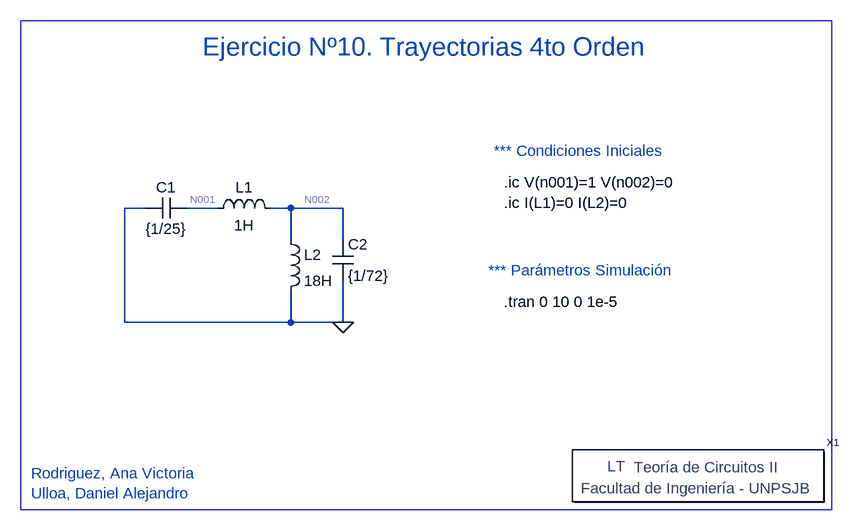
[diagram p0: schematic 10.asc]
10.asc, the LTspice schematic file:
Version 4
SHEET 1 1860 1348
WIRE -144 -32 -176 -32
WIRE -32 -32 -80 -32
WIRE 80 -32 48 -32
WIRE 160 -32 80 -32
WIRE 80 16 80 -32
WIRE 160 16 160 -32
WIRE -176 144 -176 -32
WIRE 80 144 80 96
WIRE 80 144 -176 144
WIRE 160 144 160 80
WIRE 160 144 80 144
FLAG 160 144 0
SYMBOL Circuitos2\\Letreros\\Teoría\ de\ Circuitos\ II 704 384 R0
SYMATTR InstName X1
SYMBOL ind -48 -16 R270
WINDOW 0 32 56 VTop 2
WINDOW 3 5 56 VBottom 2
SYMATTR InstName L1
SYMATTR Value 1H
SYMBOL cap -80 -48 R90
WINDOW 0 0 32 VBottom 2
WINDOW 3 32 32 VTop 2
SYMATTR InstName C1
SYMATTR Value {1/25}
SYMBOL ind 64 0 R0
SYMATTR InstName L2
SYMATTR Value 18H
SYMBOL cap 144 16 R0
SYMATTR InstName C2
SYMATTR Value {1/72}
TEXT 288 -280 Center 4 ;Ejercicio Nº10. Trayectorias 4to Orden
TEXT -320 376 Left 2 ;Rodriguez, Ana Victoria\nUlloa, Daniel Alejandro
TEXT 392 -120 Left 2 ;*** Condiciones Iniciales
TEXT 384 64 Left 2 ;*** Parámetros Simulación
TEXT 408 -72 Left 2 !.ic V(n001)=1 V(n002)=0
TEXT 408 -40 Left 2 !.ic I(L1)=0 I(L2)=0
TEXT 408 112 Left 2 !.tran 0 10 0 1e-5
RECTANGLE Normal 912 432 -336 -320

The netlist it stands for:
* 10.asc
XX1 Teoría de Circuitos II
L1 N001 N002 1H
C1 N001 0 {1/25}
L2 N002 0 18H
C2 N002 0 {1/72}
* Ejercicio Nº10. Trayectorias 4to Orden
* Rodriguez, Ana Victoria
* Ulloa, Daniel Alejandro
* *** Condiciones Iniciales
* *** Parámetros Simulación
.ic V(n001)=1 V(n002)=0
.ic I(L1)=0 I(L2)=0
.tran 0 10 0 1e-5
.backanno
.end